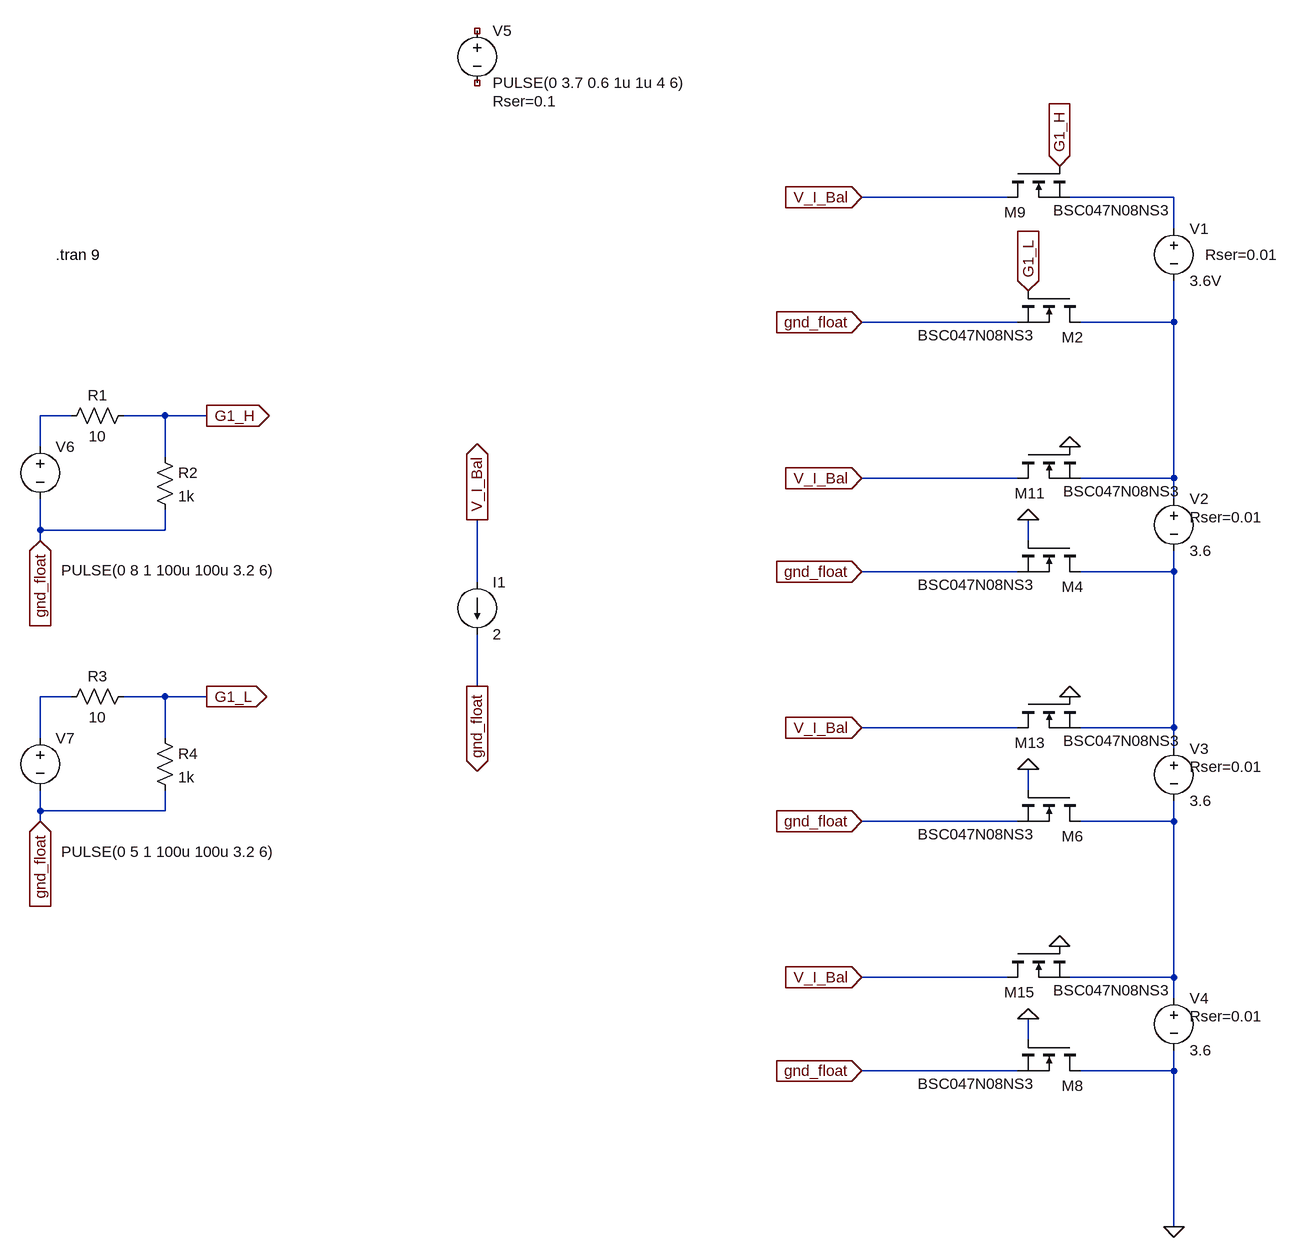
[diagram p0: schematic Simulation_Kurzschluss.asc]
Simulation_Kurzschluss.asc, the LTspice schematic file:
Version 4.1
SHEET 1 1152 1364
WIRE -224 -288 -448 -288
WIRE 32 -288 -128 -288
WIRE 32 -240 32 -288
WIRE -208 -96 -448 -96
WIRE 32 -96 32 -160
WIRE 32 -96 -112 -96
WIRE -1664 48 -1712 48
WIRE -1520 48 -1584 48
WIRE -1456 48 -1520 48
WIRE -1712 96 -1712 48
WIRE -1520 112 -1520 48
WIRE -208 144 -448 144
WIRE 32 144 32 -96
WIRE 32 144 -112 144
WIRE 32 176 32 144
WIRE -1712 224 -1712 176
WIRE -1520 224 -1520 192
WIRE -1520 224 -1712 224
WIRE -1712 240 -1712 224
WIRE -192 240 -192 208
WIRE -208 288 -448 288
WIRE 32 288 32 256
WIRE 32 288 -112 288
WIRE -1040 304 -1040 208
WIRE -1040 464 -1040 384
WIRE -1664 480 -1712 480
WIRE -1520 480 -1584 480
WIRE -1456 480 -1520 480
WIRE -208 528 -448 528
WIRE 32 528 32 288
WIRE 32 528 -112 528
WIRE -1712 544 -1712 480
WIRE -1520 544 -1520 480
WIRE 32 560 32 528
WIRE -192 624 -192 592
WIRE -1712 656 -1712 624
WIRE -1520 656 -1520 624
WIRE -1520 656 -1712 656
WIRE -1712 672 -1712 656
WIRE -208 672 -448 672
WIRE 32 672 32 640
WIRE 32 672 -112 672
WIRE -224 912 -448 912
WIRE 32 912 32 672
WIRE 32 912 -128 912
WIRE 32 944 32 912
WIRE -192 1008 -192 976
WIRE -208 1056 -448 1056
WIRE 32 1056 32 1024
WIRE 32 1056 -112 1056
WIRE 32 1296 32 1056
FLAG 32 1296 0
FLAG -1040 208 V_I_Bal
IOPIN -1040 208 Out
FLAG -1040 464 gnd_float
IOPIN -1040 464 Out
FLAG -448 -288 V_I_Bal
IOPIN -448 -288 In
FLAG -448 -96 gnd_float
IOPIN -448 -96 In
FLAG -1456 48 G1_H
IOPIN -1456 48 Out
FLAG -1456 480 G1_L
IOPIN -1456 480 Out
FLAG -192 208 0
FLAG -192 592 0
FLAG -192 976 0
FLAG -144 -336 G1_H
IOPIN -144 -336 In
FLAG -128 96 0
FLAG -128 480 0
FLAG -144 864 0
FLAG -448 288 gnd_float
IOPIN -448 288 In
FLAG -448 672 gnd_float
IOPIN -448 672 In
FLAG -448 1056 gnd_float
IOPIN -448 1056 In
FLAG -1712 240 gnd_float
IOPIN -1712 240 In
FLAG -1712 672 gnd_float
IOPIN -1712 672 In
FLAG -448 144 V_I_Bal
IOPIN -448 144 In
FLAG -448 528 V_I_Bal
IOPIN -448 528 In
FLAG -448 912 V_I_Bal
IOPIN -448 912 In
FLAG -192 -144 G1_L
IOPIN -192 -144 In
SYMBOL nmos -112 -144 R90
WINDOW 0 71 -5 VRight 2
WINDOW 3 68 70 VRight 2
SYMATTR InstName M2
SYMATTR Value BSC047N08NS3
SYMBOL nmos -112 240 R90
WINDOW 0 71 -5 VRight 2
WINDOW 3 68 70 VRight 2
SYMATTR InstName M4
SYMATTR Value BSC047N08NS3
SYMBOL voltage 32 -256 R0
WINDOW 123 0 0 Left 0
WINDOW 39 48 56 Left 2
SYMATTR SpiceLine Rser=0.01
SYMATTR InstName V1
SYMATTR Value 3.6V
SYMBOL voltage 32 160 R0
WINDOW 123 0 0 Left 0
WINDOW 39 24 44 Left 2
SYMATTR SpiceLine Rser=0.01
SYMATTR InstName V2
SYMATTR Value 3.6
SYMBOL nmos -112 624 R90
WINDOW 0 71 -5 VRight 2
WINDOW 3 68 70 VRight 2
SYMATTR InstName M6
SYMATTR Value BSC047N08NS3
SYMBOL voltage 32 544 R0
WINDOW 123 0 0 Left 0
WINDOW 39 24 44 Left 2
SYMATTR SpiceLine Rser=0.01
SYMATTR InstName V3
SYMATTR Value 3.6
SYMBOL nmos -112 1008 R90
WINDOW 0 71 -5 VRight 2
WINDOW 3 68 70 VRight 2
SYMATTR InstName M8
SYMATTR Value BSC047N08NS3
SYMBOL voltage 32 928 R0
WINDOW 123 0 0 Left 0
WINDOW 39 24 44 Left 2
SYMATTR SpiceLine Rser=0.01
SYMATTR InstName V4
SYMATTR Value 3.6
SYMBOL voltage -1040 -560 R0
WINDOW 123 0 0 Left 0
WINDOW 39 24 124 Left 2
SYMATTR SpiceLine Rser=0.1
SYMATTR InstName V5
SYMATTR Value PULSE(0 3.7 0.6 1u 1u 4 6)
SYMBOL voltage -1712 80 R0
WINDOW 3 32 206 Left 2
WINDOW 123 0 0 Left 0
WINDOW 39 0 0 Left 0
SYMATTR Value PULSE(0 8 1 100u 100u 3.2 6)
SYMATTR InstName V6
SYMBOL res -1568 32 R90
WINDOW 0 0 56 VBottom 2
WINDOW 3 32 56 VTop 2
SYMATTR InstName R1
SYMATTR Value 10
SYMBOL res -1536 96 R0
SYMATTR InstName R2
SYMATTR Value 1k
SYMBOL voltage -1712 528 R0
WINDOW 3 32 191 Left 2
WINDOW 123 0 0 Left 0
WINDOW 39 0 0 Left 0
SYMATTR Value PULSE(0 5 1 100u 100u 3.2 6)
SYMATTR InstName V7
SYMBOL res -1568 464 R90
WINDOW 0 0 56 VBottom 2
WINDOW 3 32 56 VTop 2
SYMATTR InstName R3
SYMATTR Value 10
SYMBOL res -1536 528 R0
SYMATTR InstName R4
SYMATTR Value 1k
SYMBOL nmos -224 -336 M90
WINDOW 0 71 -5 VRight 2
WINDOW 3 68 70 VRight 2
SYMATTR InstName M9
SYMATTR Value BSC047N08NS3
SYMBOL nmos -208 96 M90
WINDOW 0 71 -5 VRight 2
WINDOW 3 68 70 VRight 2
SYMATTR InstName M11
SYMATTR Value BSC047N08NS3
SYMBOL nmos -208 480 M90
WINDOW 0 71 -5 VRight 2
WINDOW 3 68 70 VRight 2
SYMATTR InstName M13
SYMATTR Value BSC047N08NS3
SYMBOL nmos -224 864 M90
WINDOW 0 71 -5 VRight 2
WINDOW 3 68 70 VRight 2
SYMATTR InstName M15
SYMATTR Value BSC047N08NS3
SYMBOL current -1040 304 R0
WINDOW 123 0 0 Left 0
WINDOW 39 0 0 Left 0
SYMATTR InstName I1
SYMATTR Value 2
TEXT -1688 -200 Left 2 !.tran 9

The netlist it stands for:
* Simulation_Kurzschluss.asc
M2 N002 G1_L gnd_float gnd_float BSC047N08NS3
M4 N004 0 gnd_float gnd_float BSC047N08NS3
V1 N001 N002 3.6V Rser=0.01
V2 N002 N004 3.6 Rser=0.01
M6 N006 0 gnd_float gnd_float BSC047N08NS3
V3 N004 N006 3.6 Rser=0.01
M8 0 0 gnd_float gnd_float BSC047N08NS3
V4 N006 0 3.6 Rser=0.01
V5 NC_01 NC_02 PULSE(0 3.7 0.6 1u 1u 4 6) Rser=0.1
V6 N003 gnd_float PULSE(0 8 1 100u 100u 3.2 6)
R1 G1_H N003 10
R2 G1_H gnd_float 1k
V7 N005 gnd_float PULSE(0 5 1 100u 100u 3.2 6)
R3 G1_L N005 10
R4 G1_L gnd_float 1k
M9 V_I_Bal G1_H N001 N001 BSC047N08NS3
M11 V_I_Bal 0 N002 N002 BSC047N08NS3
M13 V_I_Bal 0 N004 N004 BSC047N08NS3
M15 V_I_Bal 0 N006 N006 BSC047N08NS3
I1 V_I_Bal gnd_float 2
.model NMOS NMOS
.model PMOS PMOS
.lib standard.mos
.tran 9
.backanno
.end